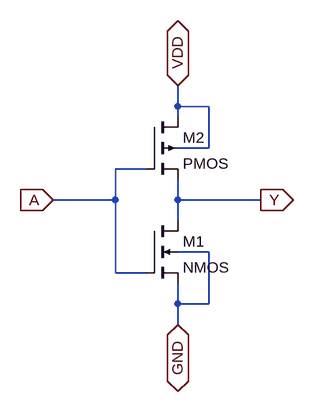
[diagram p0: schematic INV.asc]
INV.asc, the LTspice schematic file:
Version 4
SHEET 1 880 680
WIRE 208 16 208 -16
WIRE 256 16 208 16
WIRE 208 32 208 16
WIRE 256 80 256 16
WIRE 256 80 208 80
WIRE 160 112 112 112
WIRE 112 160 112 112
WIRE 112 160 16 160
WIRE 208 160 208 128
WIRE 336 160 208 160
WIRE 208 192 208 160
WIRE 256 240 208 240
WIRE 112 272 112 160
WIRE 160 272 112 272
WIRE 208 320 208 288
WIRE 256 320 256 240
WIRE 256 320 208 320
WIRE 208 352 208 320
FLAG 208 -16 VDD
IOPIN 208 -16 BiDir
FLAG 208 352 GND
IOPIN 208 352 BiDir
FLAG 16 160 A
IOPIN 16 160 In
FLAG 336 160 Y
IOPIN 336 160 Out
SYMBOL nmos4 160 192 R0
SYMATTR InstName M1
SYMATTR Value2 l=180n w=150n
SYMBOL pmos4 160 32 R0
SYMATTR InstName M2
SYMATTR Value2 l=180n w=300n

The netlist it stands for:
* INV.asc
M1 Y A GND GND NMOS l=180n w=150n
M2 VDD A Y VDD PMOS l=180n w=300n
.model NMOS NMOS
.model PMOS PMOS
.lib standard.mos
.backanno
.end